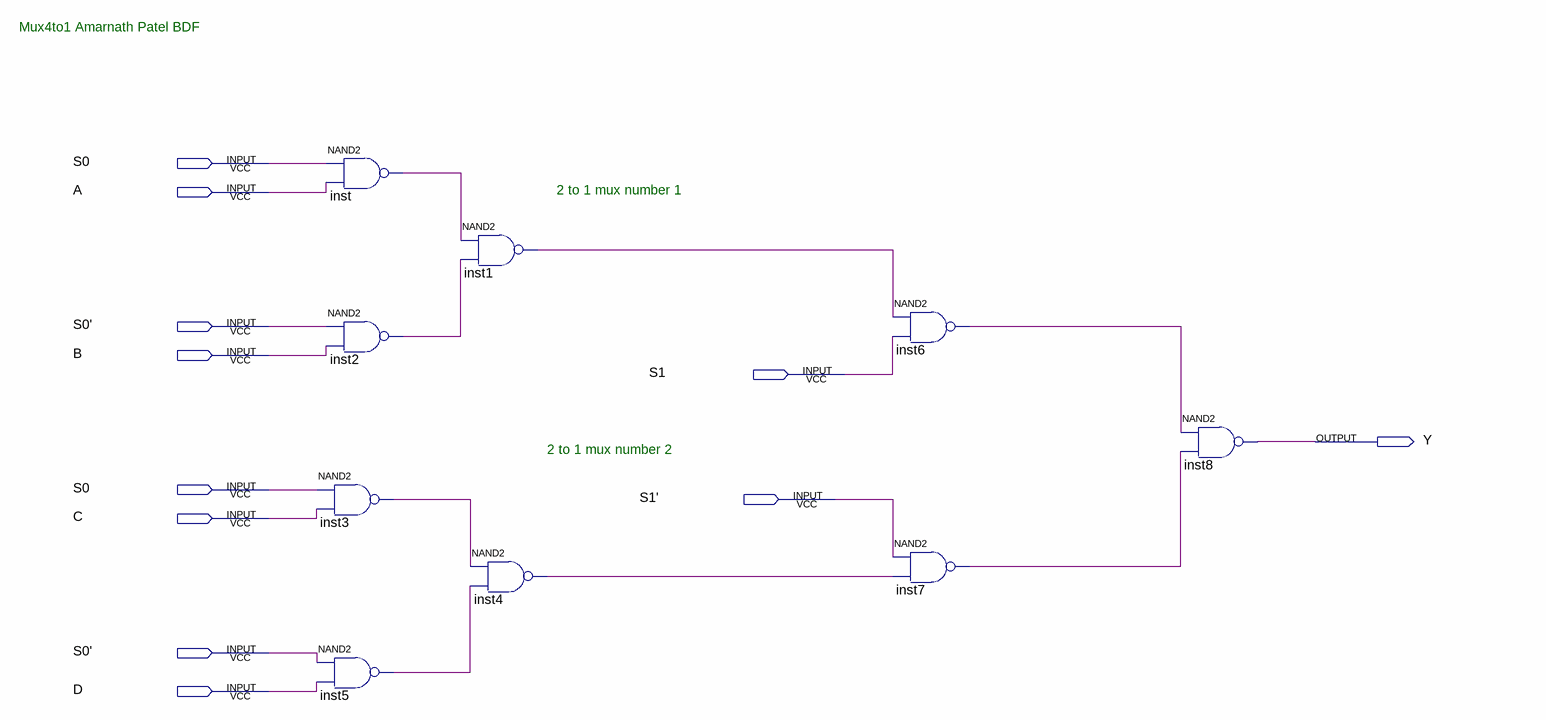
[diagram p0: schematic sheet]
// Quartus schematic Mux4to1_AmarnathPatelBDF.bdf as structural Verilog: 9 symbols, 11 pins
module Mux4to1_AmarnathPatelBDF (
  input  S0,
  input  A,
  input  \S0' ,
  input  B,
  input  S1,
  input  \S1' ,
  input  C,
  input  D,
  output Y
);

  wire inst1_out, inst2_out, inst3_out, inst4_out, inst5_out, inst6_out, inst7_out, inst_out;

  nand inst (inst_out, S0, A);
  nand inst2 (inst2_out, \S0' , B);
  nand inst3 (inst3_out, S0, C);
  nand inst5 (inst5_out, \S0' , D);
  nand inst1 (inst1_out, inst_out, inst2_out);
  nand inst4 (inst4_out, inst3_out, inst5_out);
  nand inst6 (inst6_out, inst1_out, S1);
  nand inst7 (inst7_out, \S1' , inst4_out);
  nand inst8 (Y, inst6_out, inst7_out);

  // Notes on the sheet:
  //   Mux4to1 Amarnath Patel BDF
  //   2 to 1 mux number 1
  //   2 to 1 mux number 2
endmodule
